# Altium project lab1_vodorezov_usb_rs485.PrjPcb
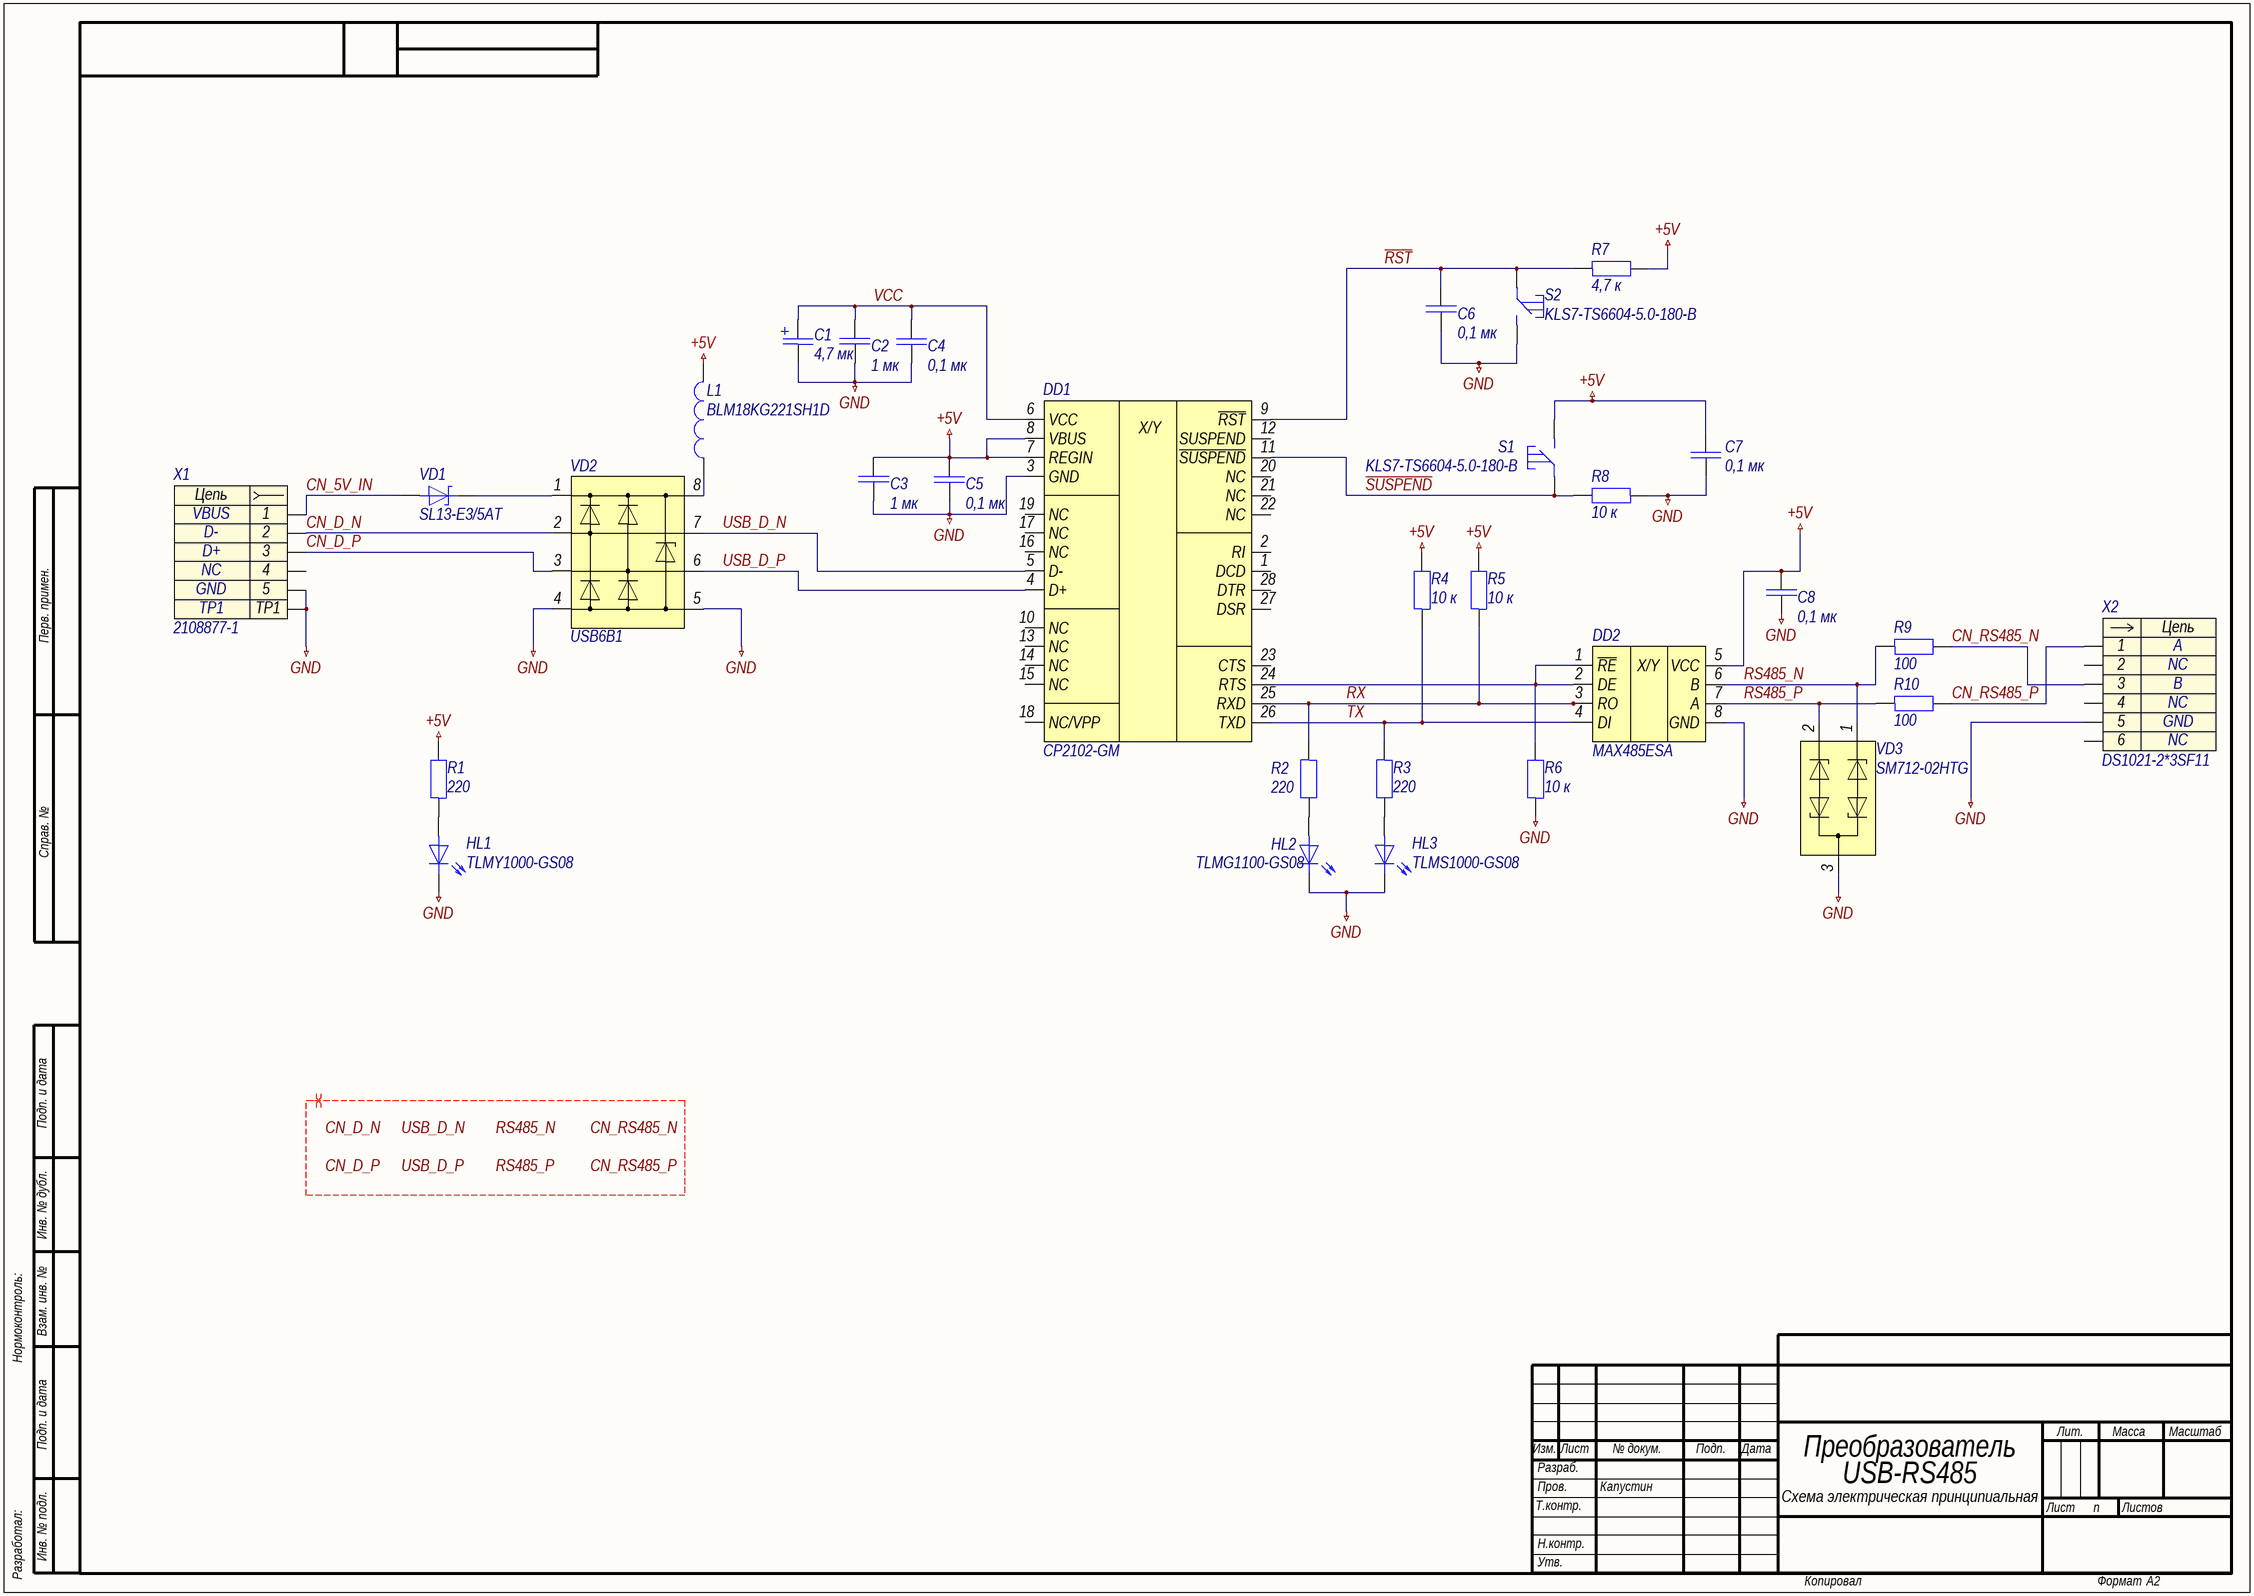
[diagram p0: lab1_vodorezov_usb_rs485.SchDoc]
title_line_2: USB-RS485; title_line_1: Преобразователь; title: Преобразователь USB-RS485; sheets_total: 1; pcb_dec_number: СПБПУ.3331506.002; document_type: Схема электрическая принципиальная; document_code: Ý3; developer: Водорезов; designation: СПБПУ.3331506.002; check: Капустин; approver: Капустин
1 sheet, 31 parts. Net scope: global (net labels, ports and power ports of the same name join across sheets).
Board file: lab1_vodorezov_usb_rs485.PcbDoc

## Sheet lab1_vodorezov_usb_rs485.SchDoc: Преобразователь USB-RS485
size 594 x 420 mm; ApprovedBy: Капустин; CheckedBy: Капустин; DrawnBy: Водорезов; DocumentNumber: СПБПУ.3331506.002Ý3; SheetNumber: n; SheetTotal: 1; DocumentCode: Ý3; ImagePath: СПБПУ.3331506.002

### Parts
C1  4,7 мк  [C1206POLAR]
C2  1 мк  [C0603]
C3  1 мк  [C0603]
C4  0,1 мк  [C0603]
C5  0,1 мк  [C0603]
C6  0,1 мк  [C0603]
C7  0,1 мк  [C0603]
C8  0,1 мк  [C0603]
DD1  CP2102-GM  [QFN-28]
DD2  MAX485ESA  [SOIC-8]
HL1  TLMY1000-GS08  [HL0603]
HL2  TLMG1100-GS08  [HL0603]
HL3  TLMS1000-GS08  [HL0603]
L1  BLM18KG221SH1D  [BLM-2-0603]
R1  220  [R0603]
R2  220  [R0603]
R3  220  [R0603]
R4  10 к  [R0603]
R5  10 к  [R0603]
R6  10 к  [R0603]
R7  4,7 к  [R0603]
R8  10 к  [R0603]
R9  100  [R0603]
R10  100  [R0603]
S1  KLS7-TS6604-5.0-180-B  [KLS7-TS6604-5.0-180-B]
S2  KLS7-TS6604-5.0-180-B  [KLS7-TS6604-5.0-180-B]
VD1  SL13-E3/5AT  [DO-214AC]
VD2  USB6B1  [SO-8]
VD3  SM712-02HTG  [SOT23-3]
X1  2108877-1  [2108877-1]
X2  DS1021-2*3SF11  [DS1021-2X3SF11]

### Nets
+5V: C3.1 C5.2 C7.2 C8.1 DD1.7(REGIN) DD1.8(VBUS) DD2.5(VCC) L1.2 R1.2 R4.2 R5.2 R7.2 S1.2
GND: C1.2 C2.2 C3.2 C4.1 C5.1 C6.2 C7.1 C8.2 DD1.3(GND) DD2.8(GND) HL1.1 HL2.1 HL3.1 R6.1 R8.1 S2.2 VD2.4 VD2.5 VD3.3 X1.5 X1.TP1 X2.5
~{RST}: C6.1 DD1.9(~{RST}) R7.1 S2.1
~{SUSPEND}: DD1.11(~{SUSPEND}) R8.2 S1.1
CN_5V_IN: VD1.2 X1.1
CN_D_N: VD2.2 X1.2
CN_D_P: VD2.3 X1.3
CN_RS485_N: R9.2 X2.3
CN_RS485_P: R10.2 X2.1
RS485_N: DD2.6(B) R9.1 VD3.1
RS485_P: DD2.7(A) R10.1 VD3.2
RX: DD1.25(RXD) DD2.3(RO) R2.1 R5.1
TX: DD1.26(TXD) DD2.4(DI) R3.1 R4.1
USB_D_N: DD1.5(D-) VD2.7
USB_D_P: DD1.4(D+) VD2.6
VCC: C1.1 C2.1 C4.2 DD1.6(VCC)
NetDD1_24: DD1.24(RTS) DD2.1(~{RE}) DD2.2(DE) R6.2
NetHL1_2: HL1.2 R1.1
NetHL2_2: HL2.2 R2.2
NetHL3_2: HL3.2 R3.2
NetL1_1: L1.1 VD2.8
NetVD1_1: VD1.1 VD2.1

Not connected (* = marked no-connect by the designer): DD1 1(DCD) 2(RI) 10(NC) 12(SUSPEND) 13(NC) 14(NC) 15(NC) 16(NC) 17(NC) 18(NC/VPP) 19(NC) 20(NC) 21(NC) 22(NC) 23(CTS) 27(DSR) 28(DTR); X1 4; X2 2 4 6

### Layout directives
differential pair; rule Differential Pairs Routing [Pref Gap = 0.254mm    Min Gap  = 0.254mm    Max Gap  = 0.254mmPref Width = 0.381mm    Min Width  = 0.381mm    Max Width  = 0.381mm]; differential pair class DIFF_PAIRS: CN_D_N, CN_D_P, CN_RS485_N, CN_RS485_P, RS485_N, RS485_P, USB_D_N, USB_D_P

### Notes on the sheet
- Labels drawn without touching a wire or pin: CN_D_N, CN_D_P, CN_RS485_N, CN_RS485_P, RS485_N, RS485_P, USB_D_N, USB_D_P
- Перв. примен.
- Справ. №
- Подп. и дата
- Инв. № дубл.
- Нормоконтроль:
- Взам. инв. №
- Изм.
- Лист
- № докум.
- Подп.
- Дата
- Лит.
- Масса
- Масштаб
- Т.контр.
- Пров.
- Разраб.
- Листов
- Разработал:
- Инв. № подл.
- Н.контр.
- Утв.
- Копировал
- Формат
- А2
- (in symbol dd0008) X/Y
- (in symbol dd0009) X/Y
- (in symbol x0001) Цепь
- (in symbol x0003) Цепь

### Library data of the parts
C1 = c0009: =Описание; ID: c0009; Фамилия: Водорезов; Описание: Конденсатор чип 1206 4,7 мкФ 25 В ±10 % полярный; Наименование: 293D105X9025A2TE3; Производитель: Vishay Intertechnology, Inc.; Отклонение: ±10 %; Номинальное напряжение: 25 В; Рабочие температуры: от -55 °С до +125 °С; Корпус: 1206; Номинал: 4,7 мк; HelpURL: https://www.vishay.com/capacitors/list/product-40002/
C2 C3 = c0004: =Описание; ID: c0004; Фамилия: Ларионов; Описание: Конденсатор чип 0603 1 мкФ 25 В ±10 %; Наименование: CC0603KRX7R8BB105; Производитель: Yageo; Отклонение: ±10 %; Номинальное напряжение: 25 В; Рабочие температуры: от -55 °С до +125 °С; Корпус: 0603; Номинал: 1 мк; HelpURL: https://www.yageo.com/upload/media/product/products/datasheet/mlcc/UPY-GPHC_X7R_6.3V-to-50V_20.pdf
C4-C8 = c0002: =Описание; ID: c0002; Фамилия: Ларионов; Описание: Конденсатор чип 0603 0,1 мкФ 50 В ±5 %; Наименование: CC0603JRX7R9BB104; Производитель: Yageo; Отклонение: ±5 %; Номинальное напряжение: 50 В; Рабочие температуры: от -55 °С до +125 °С; Корпус: 0603; Номинал: 0,1 мк; HelpURL: https://www.yageo.com/upload/media/product/products/datasheet/mlcc/UPY-GPHC_X7R_6.3V-to-50V_20.pdf
DD1 = dd0008: =Описание; ID: dd0008; Фамилия: Водорезов; Описание: Преобразователь USB-UART; Производитель: Silicon Laboratories Inc.; Наименование: CP2102-GM; Корпус: QFN-28; HelpURL: https://www.silabs.com/interface/usb-bridges/classic/device.cp2102
DD2 = dd0009: =Описание; ID: dd0009; Фамилия: Водорезов; Описание: Передатчик RS-485/RS-422; Производитель: Maxim Integrated Products; Наименование: MAX485ESA; Корпус: SOIC-8; HelpURL: https://www.maximintegrated.com/en/products/interface/transceivers/MAX485.html
HL1 = hl0003: =Описание; ID: hl0003; Фамилия: Ларионов; Описание: Светодиод чип 0603 желтый; Производитель: Vishay Intertechnology, Inc.; Цвет: Yellow; Номинальная сила света: 7,5 мкд; Номинальная длина волны: 588 нм; Номинальный прямой ток: 15 мА; Номинальное падение напряжения: 1,8 В; Рассеиваемая мощность: 40 мВт; Рабочие температуры: от -40 °С до +100 °С; Корпус: 0603; Наименование: TLMY1000-GS08; HelpURL: https://www.vishay.com/leds/list/product-83172/
HL2 = hl0005: =Описание; ID: hl0005; Фамилия: Ларионов; Описание: Светодиод чип 0603 зеленый; Производитель: Vishay Intertechnology, Inc.; Цвет: Green; Номинальная сила света: 35 мкд; Номинальная длина волны: 570 нм; Номинальный прямой ток: 30 мА; Номинальное падение напряжения: 2,1 В; Рассеиваемая мощность: 90 мВт; Рабочие температуры: от -40 °С до +100 °С; Корпус: 0603; Наименование: TLMG1100-GS08; HelpURL: https://www.vishay.com/leds/list/product-83173/
HL3 = hl0001: =Описание; ID: hl0001; Фамилия: Ларионов; Описание: Светодиод чип 0603 красный; Производитель: Vishay Intertechnology, Inc.; Цвет: Red; Номинальная сила света: 4 мкд; Номинальная длина волны: 628 нм; Номинальный прямой ток: 15 мА; Номинальное падение напряжения: 1,8 В; Рассеиваемая мощность: 40 мВт; Рабочие температуры: от -40 °С до +100 °С; Корпус: 0603; Наименование: TLMS1000-GS08; HelpURL: https://www.vishay.com/leds/list/product-83172/
L1 = l0001: =Описание; ID: l0001; Фамилия: Ларионов; Описание: Ферритовая бусина 220 Ом ±25 %; Производитель: Murata Manufacturing Co., Ltd.; Сопротивление, 100 МГц: 220 Ом; Отклонение, 100 Мгц: ±25 %; Сопротивление при постоянном токе: 0,05 Ом; Рабочие температуры: от -55 °С до +125 °С; Корпус: 0603; Наименование: BLM18KG221SH1D; HelpURL: https://www.murata.com/en-global/products/productdetail.aspx?partno=BLM18KG221SH1%23
R1-R3 = r0005: =Описание; ID: r0005; Фамилия: Ларионов; Описание: Резистор чип 0603 220 Ом ±1 % 0,1 Вт; Наименование: RC0603FR-07220RL; Производитель: Yageo; Отклонение: ±1 %; Номинальное напряжение: 75 В; Рабочие температуры: от -55 °С до +155 °С; Номинальный ток: 1 А; Корпус: 0603; Номинал: 220; HelpURL: https://www.yageo.com/upload/media/product/productsearch/datasheet/rchip/PYu-RC_Group_51_RoHS_L_11.pdf
R4-R6 R8 = r0008: =Описание; ID: r0008; Фамилия: Самарин; Описание: Резистор чип 0603 10 кОм ±1 % 0,1 Вт; Наименование: RC0603FR-0710KL; Производитель: Yageo; Отклонение: ±1 %; Номинальное напряжение: 75 В; Рабочие температуры: от -55 °С до +155 °С; Номинальный ток: 1 А; Корпус: 0603; Номинал: 10 к; HelpURL: https://www.yageo.com/upload/media/product/productsearch/datasheet/rchip/PYu-RC_Group_51_RoHS_L_11.pdf
R7 = r0007: =Описание; ID: r0007; Фамилия: Ларионов; Описание: Резистор чип 0603 4,7 кОм ±1 % 0,1 Вт; Наименование: RC0603FR-074K7L; Производитель: Yageo; Отклонение: ±1 %; Номинальное напряжение: 75 В; Рабочие температуры: от -55 °С до +155 °С; Номинальный ток: 1 А; Корпус: 0603; Номинал: 4,7 к; HelpURL: https://www.yageo.com/upload/media/product/productsearch/datasheet/rchip/PYu-RC_Group_51_RoHS_L_11.pdf
R9 R10 = r0004: =Описание; ID: r0004; Фамилия: Самарин; Описание: Резистор чип 0603 100 Ом ±1 % 0,1 Вт; Наименование: RC0603FR‍‐07100RL; Производитель: Yageo; Отклонение: ±1 %; Номинальное напряжение: 75 В; Рабочие температуры: от -55 °С до +155 °С; Номинальный ток: 1 А; Корпус: 0603; Номинал: 100; HelpURL: https://www.yageo.com/upload/media/product/productsearch/datasheet/rchip/PYu-RC_Group_51_RoHS_L_11.pdf
S1 S2 = KLS7-TS6604-5.0-180-B: id: sw0003; Капустин: Черемный; Описание: Тактовая кнопка поверхностного монтажа; Производитель: KLS; Количество контактов: 4; Ток нагрузки: 50 мА @ 12 В; Сопротивление контакта: 50 мОм; Промывка: Не указано (запрещена); Температура окружающей среды (корпуса), мин#: -20 °C; Температура окружающей среды (корпуса), макс#: +70 °C; Корпус: 6х6х3,5; Наименование: KLS7-TS6604-5.0-180-B; HelpURL: http://www.klsele.com/admin/product_upload/20120515130956KLS7-TS6604.pdf
VD1 = vd0001: =Описание; ID: vd0001; Фамилия: Ларионов; Описание: Диод Шоттки 30 В 1,5 А; Производитель: Vishay Intertechnology, Inc.; Пиковое прямое напряжение: 0,445 В; Импульсное обратное напряжение: 30 В; Макс# допустимый средний прямой ток: 1,5 А; Рабочие температуры: от -55 °С до +125 °С; Наименование: SL13-E3/5AT; Корпус: DO-214AC; HelpURL: https://www.vishay.com/product?docid=88740
VD2 = vd0005: =Описание; ID: vd0005; Фамилия: Ларионов; Описание: Диодная сборка для подавления помех, от 6 В; Производитель: STMicroelectronics; Наименование: USB6B1; Корпус: SO-8; HelpURL: https://www.st.com/content/st_com/en/products/protection-devices/esd-protection/usb-port-protection/usb6b1.html
VD3 = vd0003: =Описание; ID: vd0003; Фамилия: Самарин; Описание: Диодная сборка для подавления помех, -7/12 В; Производитель: Littelfuse, Inc.; Наименование: SM712-02HTG; Корпус: SOT23-3; HelpURL: https://www.littelfuse.com/products/tvs-diode-arrays/general-purpose-esd-protection/sm712.aspx
X1 = x0001: Contact_1: VBUS; Contact_2: D-; Contact_3: D+; Contact_4: NC; Contact_5: GND; ID: x0001; Фамилия: Ларионов; Описание: USB 2.0 Micro USB Type B IP68 гнездо прямой угол; Производитель: TE Connectivity; Наименование: 2108877-1; HelpURL: https://www.te.com/global-en/product-2108877-1.html
X2 = x0003: Contact_1: A; Contact_2: NC; Contact_3: B; Contact_5: GND; ID: x0003; Фамилия: Самарин; Описание: PLS 3x2 pin 2,54 мм прямой; Производитель: Connfly Electronic Co. LTD; Contact_4: NC; Contact_6: NC; Наименование: DS1021-2*3SF11; HelpURL: http://www.connfly.com/productshow.aspx?id=118